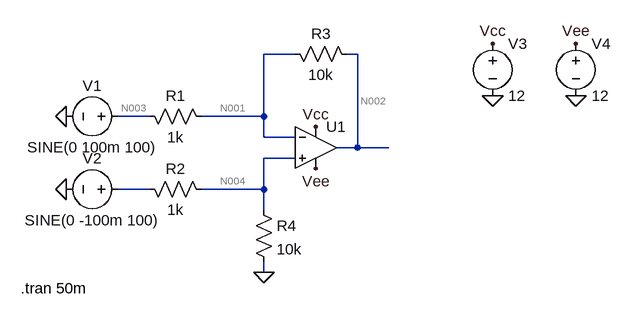
[diagram p0: schematic Amplificator_Diferential_AO.asc]
Amplificator_Diferential_AO.asc, the LTspice schematic file:
Version 4
SHEET 1 880 680
WIRE 208 -384 160 -384
WIRE 304 -384 288 -384
WIRE -16 -288 -64 -288
WIRE 160 -288 160 -384
WIRE 160 -288 64 -288
WIRE 160 -256 160 -288
WIRE 208 -256 160 -256
WIRE 304 -240 304 -384
WIRE 304 -240 272 -240
WIRE 352 -240 304 -240
WIRE 208 -224 160 -224
WIRE -16 -176 -64 -176
WIRE 160 -176 160 -224
WIRE 160 -176 64 -176
WIRE 160 -144 160 -176
WIRE 160 -48 160 -64
FLAG 160 -48 0
FLAG -144 -288 0
FLAG -144 -176 0
FLAG 512 -400 Vcc
FLAG 240 -272 Vcc
FLAG 640 -400 Vee
FLAG 240 -208 Vee
FLAG 512 -320 0
FLAG 640 -320 0
SYMBOL res -32 -304 M90
WINDOW 0 0 56 VBottom 2
WINDOW 3 32 56 VTop 2
SYMATTR InstName R1
SYMATTR Value 1k
SYMBOL res -32 -192 M90
WINDOW 0 0 56 VBottom 2
WINDOW 3 32 56 VTop 2
SYMATTR InstName R2
SYMATTR Value 1k
SYMBOL res 192 -400 M90
WINDOW 0 0 56 VBottom 2
WINDOW 3 32 56 VTop 2
SYMATTR InstName R3
SYMATTR Value 10k
SYMBOL res 144 -160 R0
SYMATTR InstName R4
SYMATTR Value 10k
SYMBOL voltage -48 -288 R90
WINDOW 0 -32 56 VBottom 2
WINDOW 3 32 56 VTop 2
WINDOW 123 0 0 Left 0
WINDOW 39 0 0 Left 0
SYMATTR InstName V1
SYMATTR Value SINE(0 100m 100)
SYMBOL voltage -48 -176 R90
WINDOW 0 -32 56 VBottom 2
WINDOW 3 32 56 VTop 2
WINDOW 123 0 0 Left 0
WINDOW 39 0 0 Left 0
SYMATTR InstName V2
SYMATTR Value SINE(0 -100m 100)
SYMBOL OpAmps\\UniversalOpAmp 240 -240 R0
SYMATTR InstName U1
SYMBOL voltage 512 -416 R0
WINDOW 123 0 0 Left 0
WINDOW 39 0 0 Left 0
SYMATTR InstName V3
SYMATTR Value 12
SYMBOL voltage 640 -416 R0
WINDOW 123 0 0 Left 0
WINDOW 39 0 0 Left 0
SYMATTR InstName V4
SYMATTR Value 12
TEXT -214 -24 Left 2 !.tran 50m

The netlist it stands for:
* Amplificator_Diferential_AO.asc
R1 N003 N001 1k
R2 N005 N004 1k
R3 N001 N002 10k
R4 N004 0 10k
V1 N003 0 SINE(0 100m 100)
V2 N005 0 SINE(0 -100m 100)
XU1 N004 N001 Vcc Vee N002 level1 Avol=1Meg GBW=10Meg Vos=0 En=0 Enk=0 In=0 Ink=0 Rin=500Meg  ; pins In+ In- V+ V- OUT
V3 Vcc 0 12
V4 Vee 0 12
.tran 50m
.lib UniversalOpAmp1.lib
.backanno
.end

* Results of the author's LTspice run, read from the files saved beside the schematic
* Operating Point, zero values left out:
*   V(n001) = 21.82 µV
*   V(n004) = 21.82 µV
*   V(vcc) = 12 V
*   V(vee) = 12 V
*   I(R4) = 2.182 nA
*   I(R3) = 2.182 nA
*   I(R2) = -21.82 nA
*   I(R1) = -21.82 nA
*   I(V4) = -24 nA
*   I(V3) = -24 nA
*   I(V2) = 21.82 nA
*   I(V1) = 21.82 nA
*   Ix(u1:1) = -24 nA
*   Ix(u1:2) = -24 nA
*   Ix(u1:3) = 24 nA
*   Ix(u1:4) = 24 nA
*   Ix(u1:5) = 1.863 nA
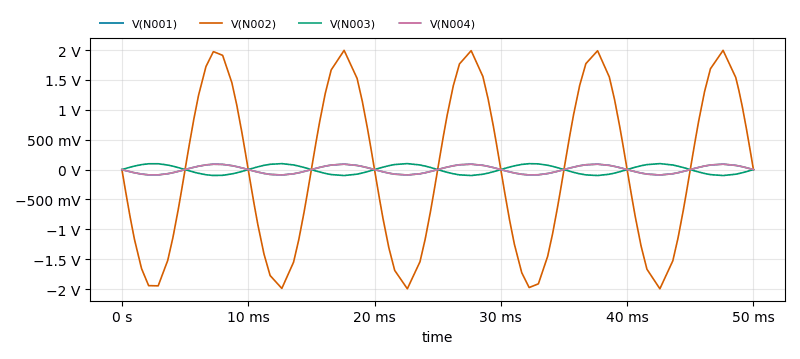
[diagram p1: Transient Analysis of Amplificator_Diferential_AO.asc, plotted from the saved traces]
* Transient Analysis, 1 run:
*   V(N001): min -90.62 mV, max 90.66 mV, average -9.265 µV, rms 63.3 mV, last 41.82 µV
*   V(N002): min -1.994 V, max 1.994 V, average -683.8 µV, rms 1.393 V, last 220 µV
*   V(N003): min -99.73 mV, max 99.73 mV, average 34.2 µV, rms 69.65 mV, last 0 V
*   V(N004): min -90.62 mV, max 90.66 mV, average -9.266 µV, rms 63.3 mV, last 21.82 µV